# EAGLE schematic pro_mini_saber (EAGLE 6.4)
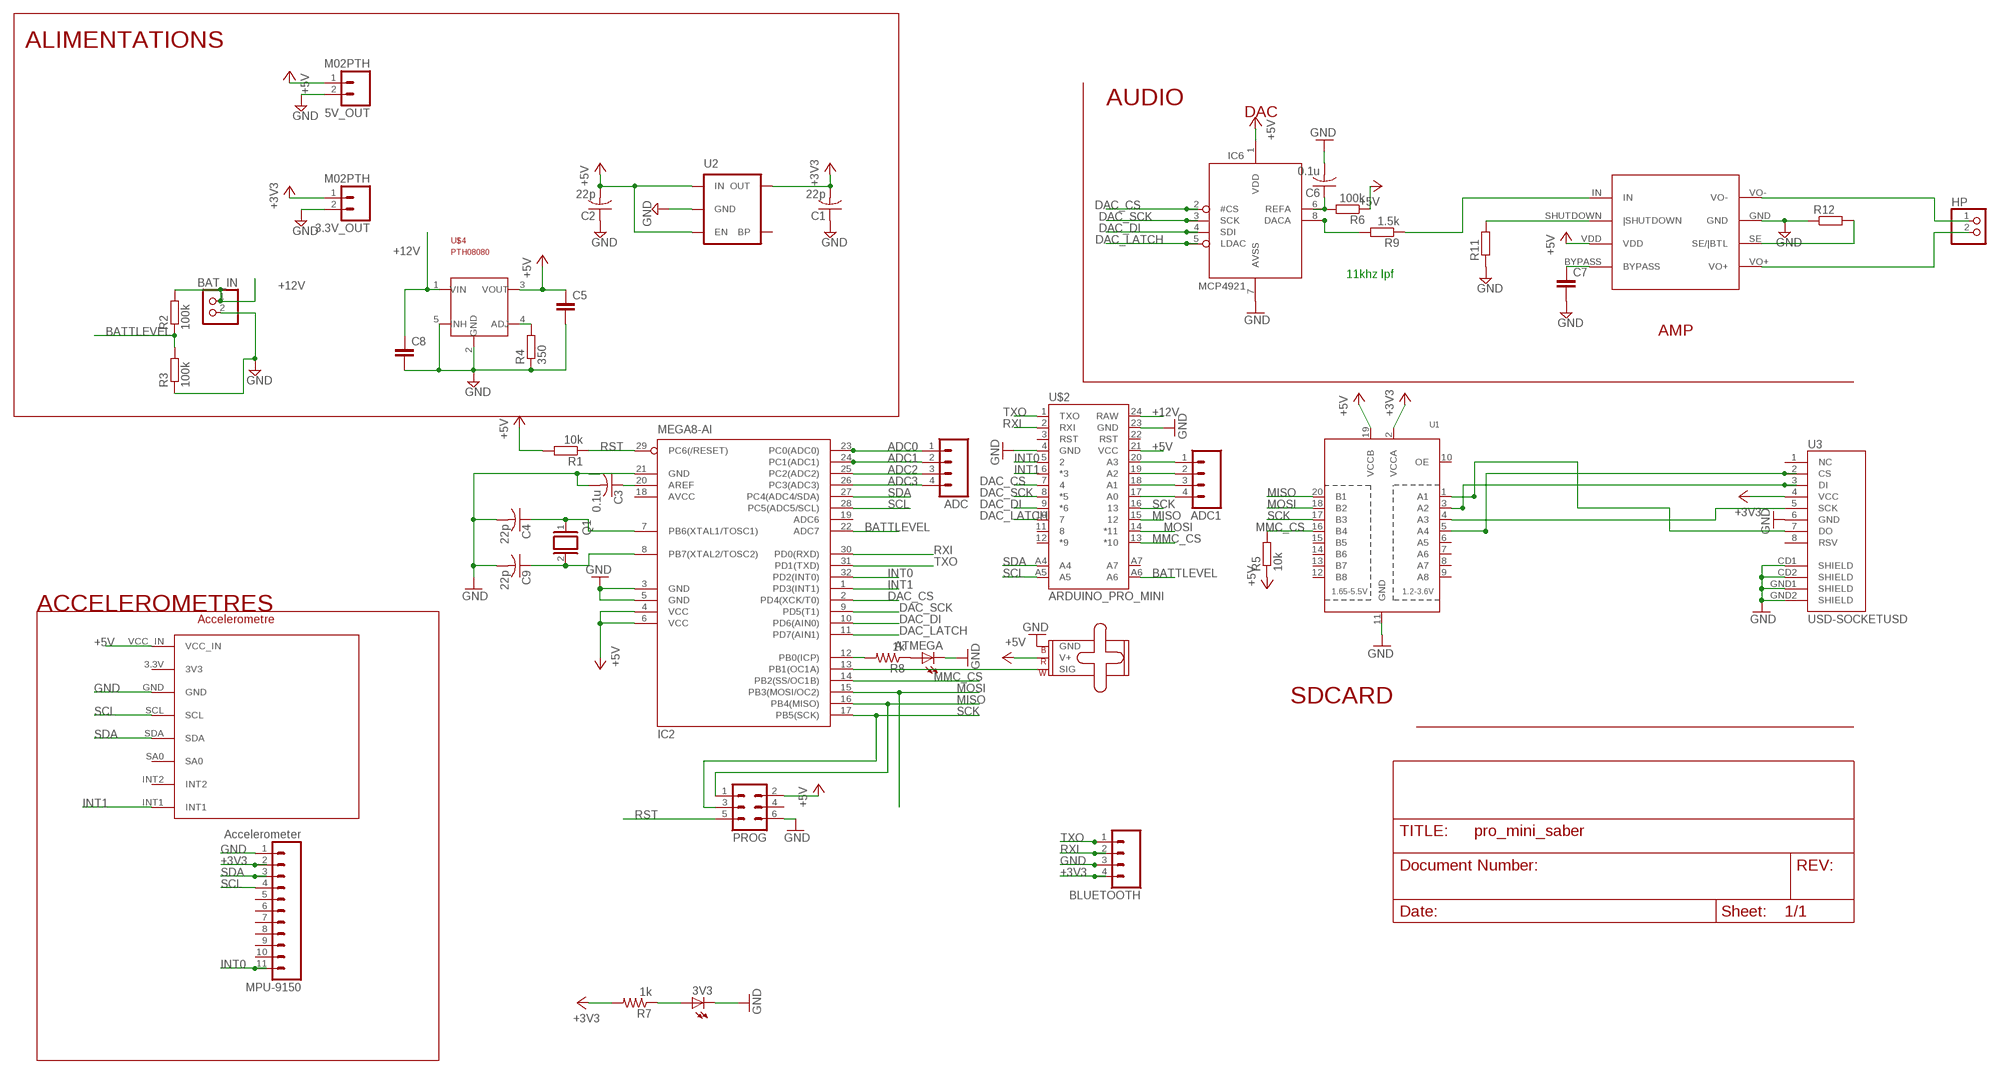
[diagram p0: schematic, sheet 1]

## Parts
3.3V_OUT  M02PTH  [1X02]
3V3  LEDSML0805  [SML0805]
5V_OUT  M02PTH  [1X02]
ADC  M04PTH  [1X04]
ADC1  M04PTH  [1X04]
ATMEGA  LEDSML0805  [SML0805]
BAT_IN  PINHD-1X2  [1X02]
BLUETOOTH  M04PTH  [1X04]
C1  22p  C-USC0805  [C0805]
C2  22p  C-USC0805  [C0805]
C3  0.1u  C-USC0805  [C0805]
C4  22p  C-USC0805  [C0805]
C5  C-EUC1206K  [C1206K]
C6  0.1u  C-USC0805  [C0805]
C7  C-EU025-025X050  [C025-025X050]
C8  C-EUC1206K  [C1206K]
C9  22p  C-USC0805  [C0805]
HP  PINHD-1X2  [1X02]
IC2  MEGA8-AI  [TQFP32-08]
IC6  MCP4921  [DIL08]
LED  SMALL_SERVO  [1X03]
MMA8451  DEV  [MMA8451]
MPU-9150  Accelerometer  M11PTH  [1X11]
PROG  MA03-2  [MA03-2]
Q1  XTAL/S  [QS]
R1  10k  R-EU_R0805  [R0805]
R2  100k  R-EU_R0805  [R0805]
R3  100k  R-EU_R0805  [R0805]
R4  350  R-EU_R0805  [R0805]
R5  10k  R-EU_R0805  [R0805]
R6  100k  R-EU_R0805  [R0805]
R7  1k  R-US_M0805  [M0805]
R8  1k  R-US_M0805  [M0805]
R9  1.5k  R-EU_R0805  [R0805]
R11  R-EU_R0805  [R0805]
R12  R-EU_R0805  [R0805]
U1  TXB0108PWR  [TSSOP20]
U2  MIC52053.3V  [SOT23-5]
U3  USD-SOCKETUSD  [USD-SOCKET-PP]
U$1  TPA0211  [TPA0211]
U$2  ARDUINO_PRO_MINI  [ARDUINO_PRO_MINI]
U$4  PTH08080  [PTH08080EUF]

## Nets
+3V3: 3.3V_OUT.1 BLUETOOTH.4 C1.2 MPU-9150.2 R7.2 U1.2(VCCA) U2.5(OUT) U3.4(VCC)
+5V: 5V_OUT.1 C2.2 C5.1 IC2.4(VCC) IC2.6(VCC) IC6.1(VDD) LED.2(V+) MMA8451.VCC_IN PROG.2 R1.2 R5.1 R6.1 U1.19(VCCB) U2.1(IN) U2.3(EN) U$1.VDD U$2.21(VCC) U$4.3(VOUT)
+12V: BAT_IN.1 C8.1 R2.2 U$2.24(RAW) U$4.1(VIN)
ADC0: ADC.1 IC2.23(PC0(ADC0))
ADC1: ADC.2 IC2.24(PC1(ADC1))
ADC2: ADC.3 IC2.25(PC2(ADC2))
ADC3: ADC.4 IC2.26(PC3(ADC3))
BATTLEVEL: IC2.22(ADC7) R2.1 R3.2 U$2.A6
DAC_CS: IC2.2(PD4(XCK/T0)) IC6.2(#CS) U$2.7
DAC_DI: IC2.10(PD6(AIN0)) IC6.4(SDI) U$2.9(*6)
DAC_LATCH: IC2.11(PD7(AIN1)) IC6.5(LDAC) U$2.10
DAC_SCK: IC2.9(PD5(T1)) IC6.3(SCK) U$2.8(*5)
GND: 3.3V_OUT.2 3V3.C 5V_OUT.2 ATMEGA.C BAT_IN.2 BLUETOOTH.3 C1.1 C2.1 C3.2 C4.2 C5.2 C6.2 C7.2 C8.2 C9.2 IC2.3(GND) IC2.5(GND) IC2.21(GND) IC6.7(AVSS) LED.3(GND) MMA8451.GND MPU-9150.1 PROG.6 R3.1 R4.1 R11.1 R12.1 U1.11(GND) U2.2(GND) U3.6(GND) U3.CD1(SHIELD) U3.CD2(SHIELD) U3.GND1(SHIELD) U3.GND2(SHIELD) U$1.GND U$2.4(GND) U$2.23(GND) U$4.2(GND) U$4.5(INH)
INT0: IC2.32(PD2(INT0)) MPU-9150.11 U$2.5
INT1: IC2.1(PD3(INT1)) MMA8451.INT1 U$2.6(*3)
MISO: IC2.16(PB4(MISO)) PROG.1 U1.20(B1) U$2.15
MMC_CS: IC2.14(PB2(SS/OC1B)) R5.2 U1.16(B4) U$2.13(*10)
MOSI: IC2.15(PB3(MOSI/OC2)) U1.18(B2) U$2.14(*11)
N$1: C9.1 IC2.8(PB7(XTAL2/TOSC2)) Q1.2
N$2: C4.1 IC2.7(PB6(XTAL1/TOSC1)) Q1.1
N$3: R9.1 U$1.IN
N$4: IC6.8(DACA) R9.2
N$5: R4.2 U$4.4(ADJ)
N$6: U1.4(A3) U3.5(SCK)
N$7: U1.1(A1) U3.7(DO)
N$8: C3.1 IC2.20(AREF)
N$9: U1.5(A4) U3.2(CS)
N$10: 3V3.A R7.1
N$11: U1.3(A2) U3.3(DI)
N$12: ATMEGA.A R8.1
N$13: ADC1.1 U$2.20(A3)
N$14: ADC1.2 U$2.19(A2)
N$15: ADC1.3 U$2.18(A1)
N$16: ADC1.4 U$2.17(A0)
N$19: C6.1 IC6.6(REFA) R6.2
N$20: IC2.13(PB1(OC1A)) LED.1(SIG)
N$22: HP.1 U$1.VO-
N$23: C7.1 U$1.BYPASS
N$32: R11.2 U$1.SHUTDOWN(|SHUTDOWN)
N$33: R12.2 U$1.SE(SE/|BTL)
RST: IC2.29(PC6(/RESET)) PROG.5 R1.1
RXI: BLUETOOTH.2 IC2.30(PD0(RXD)) U$2.2(RXI)
SCK: IC2.17(PB5(SCK)) PROG.3 U1.17(B3) U$2.16
SCL: IC2.28(PC5(ADC5/SCL)) MMA8451.SCL MPU-9150.4 U$2.A5
SDA: IC2.27(PC4(ADC4/SDA)) MMA8451.SDA MPU-9150.3 U$2.A4
TXO: BLUETOOTH.1 IC2.31(PD1(TXD)) U$2.1(TXO)
VCC2: R8.2
VO+: HP.2 U$1.VO+
Unconnected: IC2.12(PB0(ICP)) IC2.19(ADC6) MMA8451.3.3V(3V3) MMA8451.INT2 MMA8451.SA0 MPU-9150.5 MPU-9150.6 MPU-9150.7 MPU-9150.8 MPU-9150.9 MPU-9150.10 PROG.4 U1.6(A5) U1.7(A6) U1.8(A7) U1.9(A8) U1.10(OE) U1.12(B8) U1.13(B7) U1.14(B6) U1.15(B5) U2.4(BP) U3.1(NC) U3.8(RSV) U$2.3(RST) U$2.11 U$2.12(*9) U$2.22(RST) U$2.A7

## Notes on the sheet
- ALIMENTATIONS
- AUDIO
- DAC
- 11khz lpf
- AMP
- ACCELEROMETRES
- Accelerometre
- SDCARD

## Power pins joined to a net without a drawn wire
AVCC: IC2.18(AVCC)

## Library data of the parts
3.3V_OUT 5V_OUT = SparkFun-Connectors:M02: Standard 2-pin 0.1" header. Use with - straight break away headers ( PRT-00116) - right angle break away headers (PRT-00553) - swiss pins (PRT-00743) - machine pins (PRT-00117) - female headers (PRT-00115) Molex polarized connector foot print use with: PRT-08233 with associated crimp pins and housings. 2.54_SCREWTERM for use with PRT-10571. 3.5mm Screw Terminal footprints for PRT-08084 5mm Screw Terminal footprints for use with PRT-08433
3V3 ATMEGA = led:LED: LED OSRAM: - CHIPLED LG R971, LG N971, LY N971, LG Q971, LY Q971, LO R971, LY R971 LH N974, LH R974 LS Q976, LO Q976, LY Q976 LO Q996 - Hyper CHIPLED LW Q18S LB Q993, LB Q99A, LB R99A - SideLED LS A670, LO A670, LY A670, LG A670, LP A670 LB A673, LV A673, LT A673, LW A673 LH A674 LY A675 LS A676, LA A676, LO A676, LY A676, LW A676 LS A679, LY A679, LG A679 - Hyper Micro SIDELED® LS Y876, LA Y876, LO Y876, LY Y876 LT Y87S - SmartLED LW L88C, LW L88S LB L89C, LB L89S, LG L890 LS L89K, LO L89K, LY L89K LS L896, LA L896, LO L896, LY L896 - TOPLED LS T670, LO T670, LY T670, LG T670, LP T670 LSG T670, LSP T670, LSY T670, LOP T670, LYG T670 LG T671, LOG T671, LSG T671 LB T673, LV T673, LT T673, LW T673 LH T674 LS T676, LA T676, LO T676, LY T676, LB T676, LH T676, LSB T676, LW T676 LB T67C, LV T67C, LT T67C, LS T67K, LO T67K, LY T67K, LW E67C LS E67B, LA E67B, LO E67B, LY E67B, LB E67C, LV E67C, LT E67C LW T67C LS T679, LY T679, LG T679 LS T770, LO T770, LY T770, LG T770, LP T770 LB T773, LV T773, LT T773, LW T773 LH T774 LS E675, LA E675, LY E675, LS T675 LS T776, LA T776, LO T776, LY T776, LB T776 LHGB T686 LT T68C, LB T68C - Hyper Mini TOPLED® LB M676 - Mini TOPLED Santana® LG M470 LS M47K, LO M47K, LY M47K Source: http://www.osram.convergy.de LUXEON: - LUMILED® LXK2-PW12-R00, LXK2-PW12-S00, LXK2-PW14-U00, LXK2-PW14-V00 LXK2-PM12-R00, LXK2-PM12-S00, LXK2-PM14-U00 LXK2-PE12-Q00, LXK2-PE12-R00, LXK2-PE12-S00, LXK2-PE14-T00, LXK2-PE14-U00 LXK2-PB12-K00, LXK2-PB12-L00, LXK2-PB12-M00, LXK2-PB14-N00, LXK2-PB14-P00, LXK2-PB14-Q00 LXK2-PR12-L00, LXK2-PR12-M00, LXK2-PR14-Q00, LXK2-PR14-R00 LXK2-PD12-Q00, LXK2-PD12-R00, LXK2-PD12-S00 LXK2-PH12-R00, LXK2-PH12-S00 LXK2-PL12-P00, LXK2-PL12-Q00, LXK2-PL12-R00 Source: www.luxeon.com KINGBRIGHT: KA-3528ASYC Source: www.kingbright.com
ADC ADC1 BLUETOOTH = SparkFun-Connectors:M04: Header 4 Standard 4-pin 0.1" header. Use with straight break away headers (SKU : PRT-00116), right angle break away headers (PRT-00553), swiss pins (PRT-00743), machine pins (PRT-00117), and female headers (PRT-00115). Molex polarized connector foot print use with SKU : PRT-08231 with associated crimp pins and housings. 1MM SMD Version SKU: PRT-10208
BAT_IN HP = pinhead:PINHD-1X2: PIN HEADER
C1-C4 C6 C9 = adafruit:C-US: CAPACITOR, American symbol
C5 C7 C8 = rcl:C-EU: CAPACITOR, European symbol
IC2 = atmel:MEGA8: MICROCONTROLLER 8 Kbytes FLASH, 1 kbytes SRAM, 512 bytes EEPROM, USART, 6-channel 10 bit ADC, 2-channel 8 bit ADC Pin compatible with Atmega48, ATMega88, ATMega168 Source: avr.lbr
IC6 = adafruit:MCP4921
LED = SparkFun-Electromechanical:SMALL_SERVO: Small servo motor This is the small servo used in the SIK. SKU: ROB-09065
MMA8451 = MMA8451_miniboard:DEV
MPU-9150 = SparkFun-Connectors:M11: Header 11 Standard 11-pin 0.1" header. Use with straight break away headers (SKU : PRT-00116), right angle break away headers (PRT-00553), swiss pins (PRT-00743), machine pins (PRT-00117), and female headers (PRT-00115).
PROG = con-lstb:MA03-2: PIN HEADER
Q1 = special:XTAL/S: CRYSTAL
R1-R6 R9 R11 R12 = rcl:R-EU_: RESISTOR, European symbol
R7 R8 = rcl:R-US_: RESISTOR, American symbol
U1 = adafruit:TXB0108PWR: 8-Bit Bi-Directional Level Shifter 1.2V-3.6V (VCCA) to 1.65V-5.5V (VCCB) bi-directional level shifter with auto direction sensing. Max data rate - VCCA 1.8V: 20Mbps (50ns), VCCA 3.3V: 100Mbps (10ns) Digikey: 296-21527-1-ND
U2 = SparkFun-PowerIC:MIC5205: MIC5205 150mA vreg 3.3V - VREG-00822 5V - VREG-00823; PROD_ID: VREG-00822
U3 = SparkFun-Connectors:USD-SOCKET: microSD Socket Push-push type uSD socket. Schematic element and footprint production proven. Spark Fun Electronics SKU : PRT-00127. tDoc lines correctly indicate media card edge positions when inserting (unlocked, locked, depressed).
U$1 = TPA0211:TPA0211
U$2 = SparkFun-Boards:ARDUINO_PRO_MINI
U$4 = PTH08080:PTH08080: DC-DC, Vin 5..18V, Vout 2..6V, 2A www.ti.com

## Net classes
1 power: width 0.508 mm